# Altium schematic sheet Sheet1.SchDoc
size A1
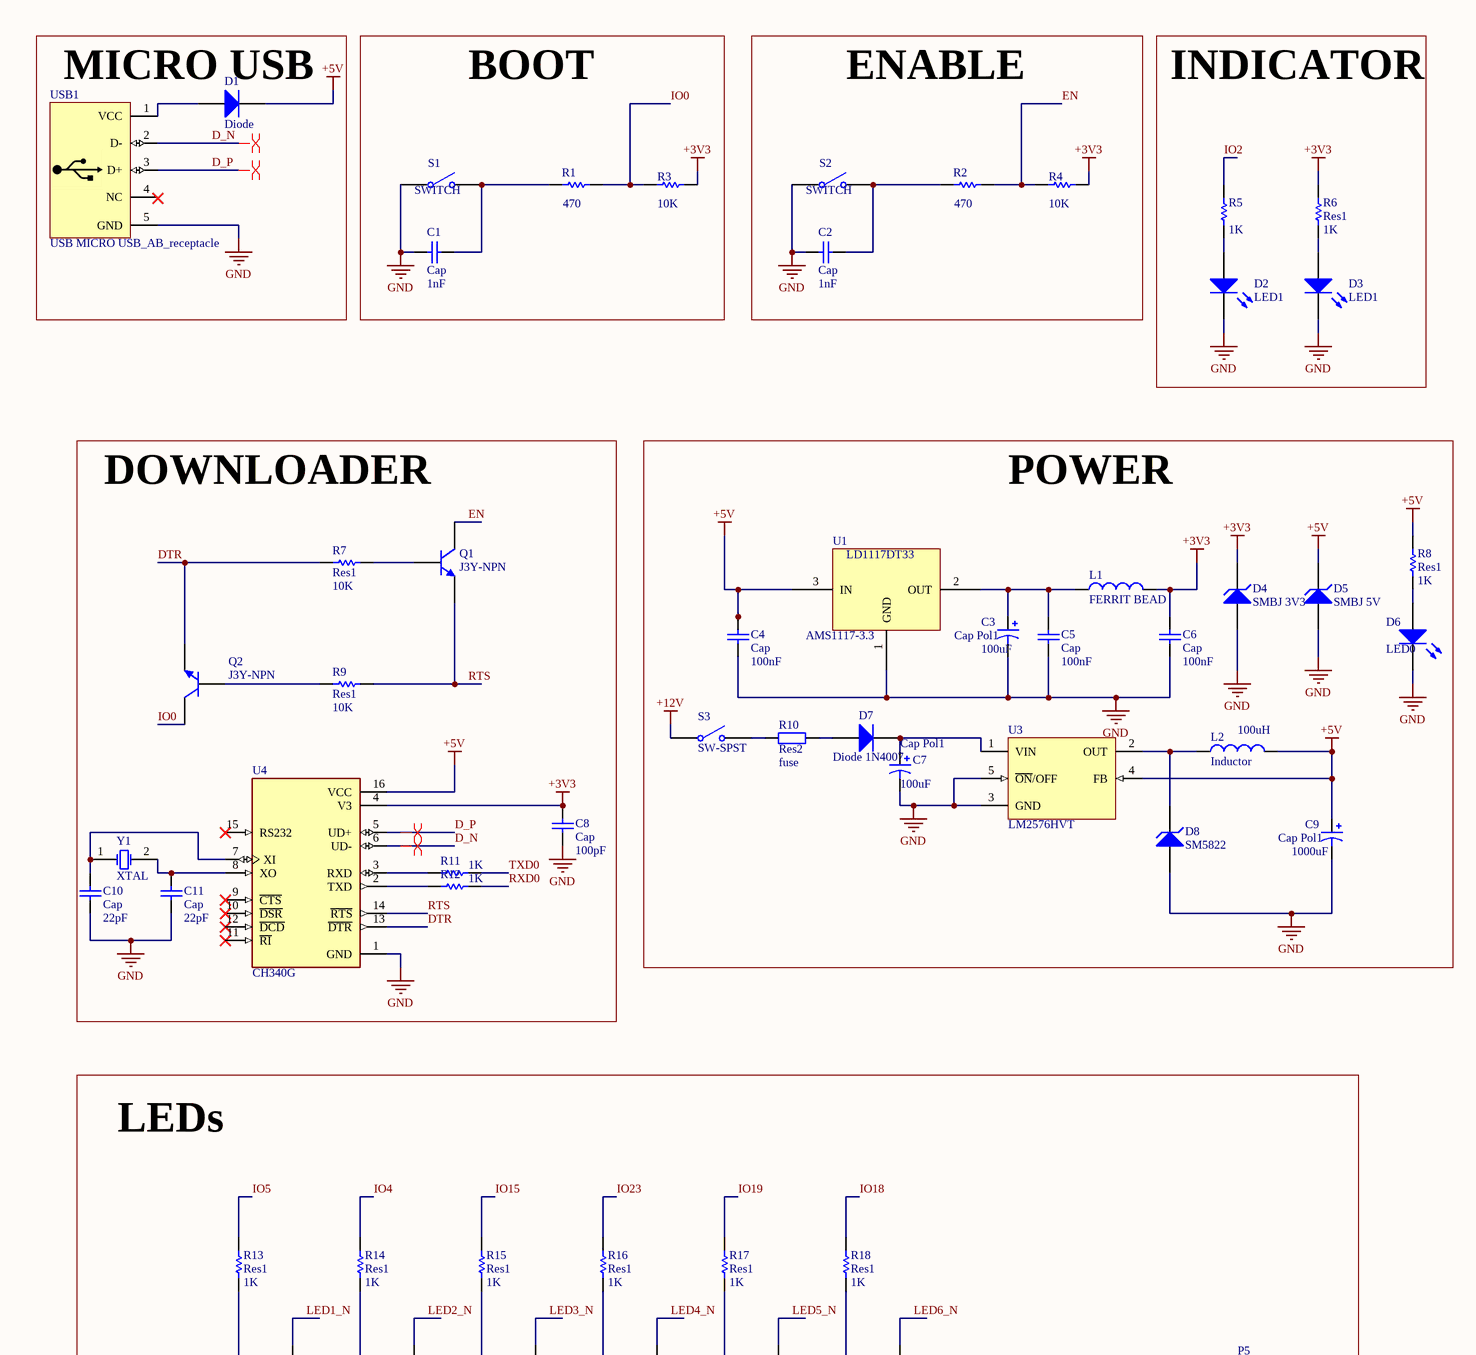
[diagram p0: Sheet1.SchDoc, top left]
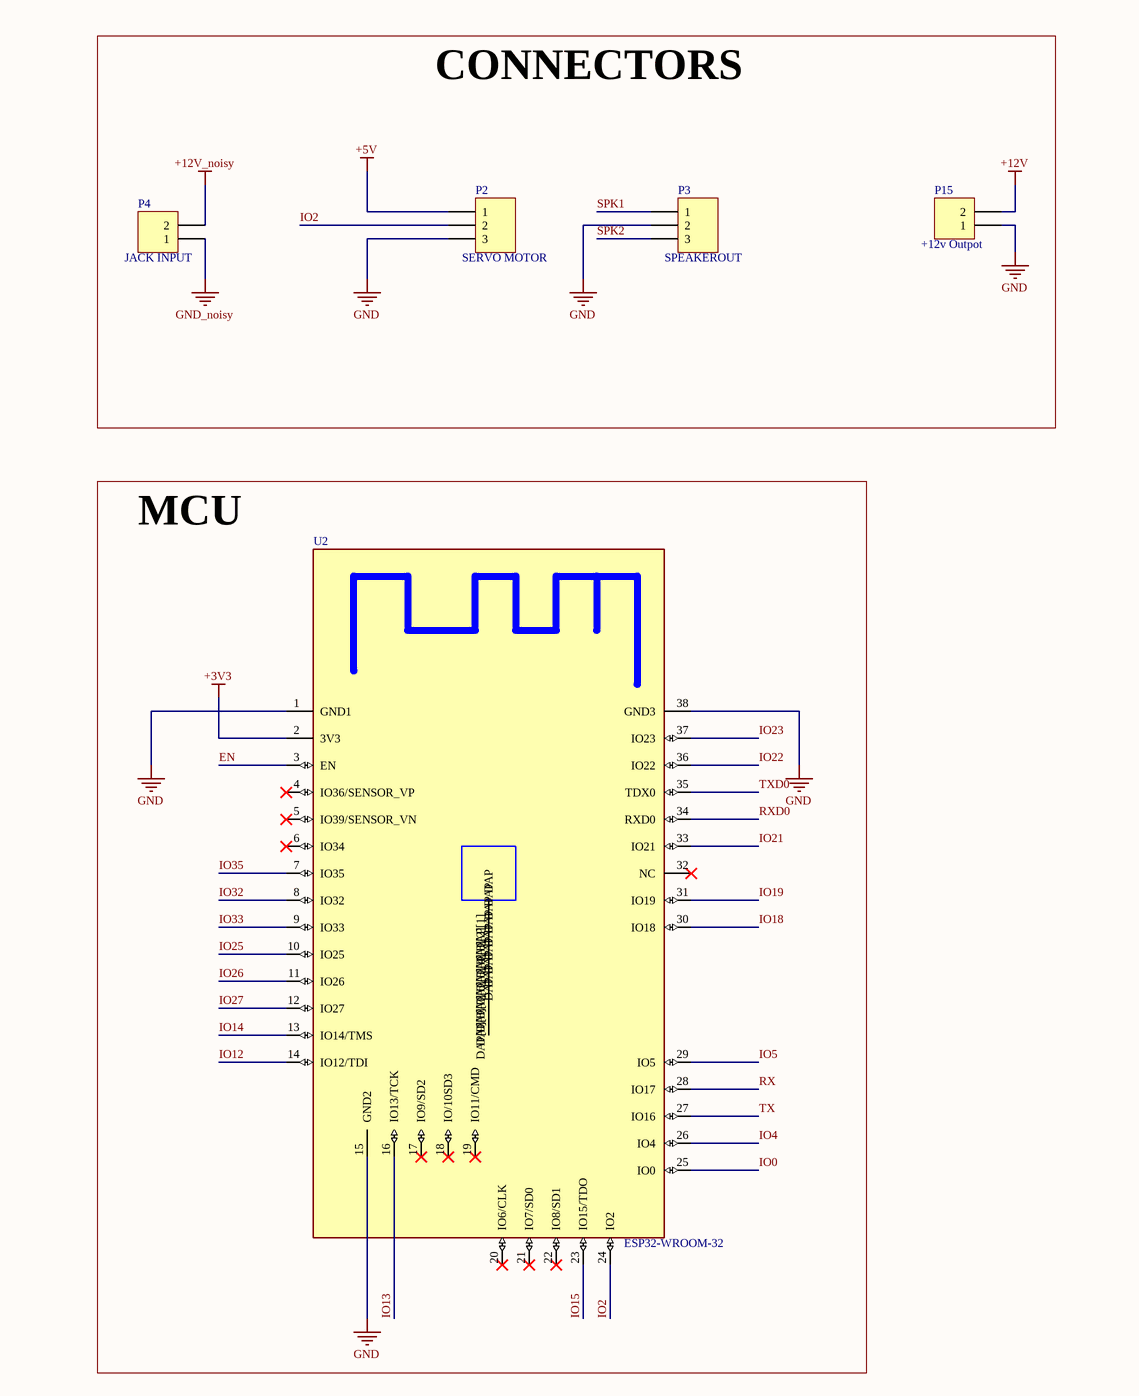
[diagram p1: Sheet1.SchDoc, top right]
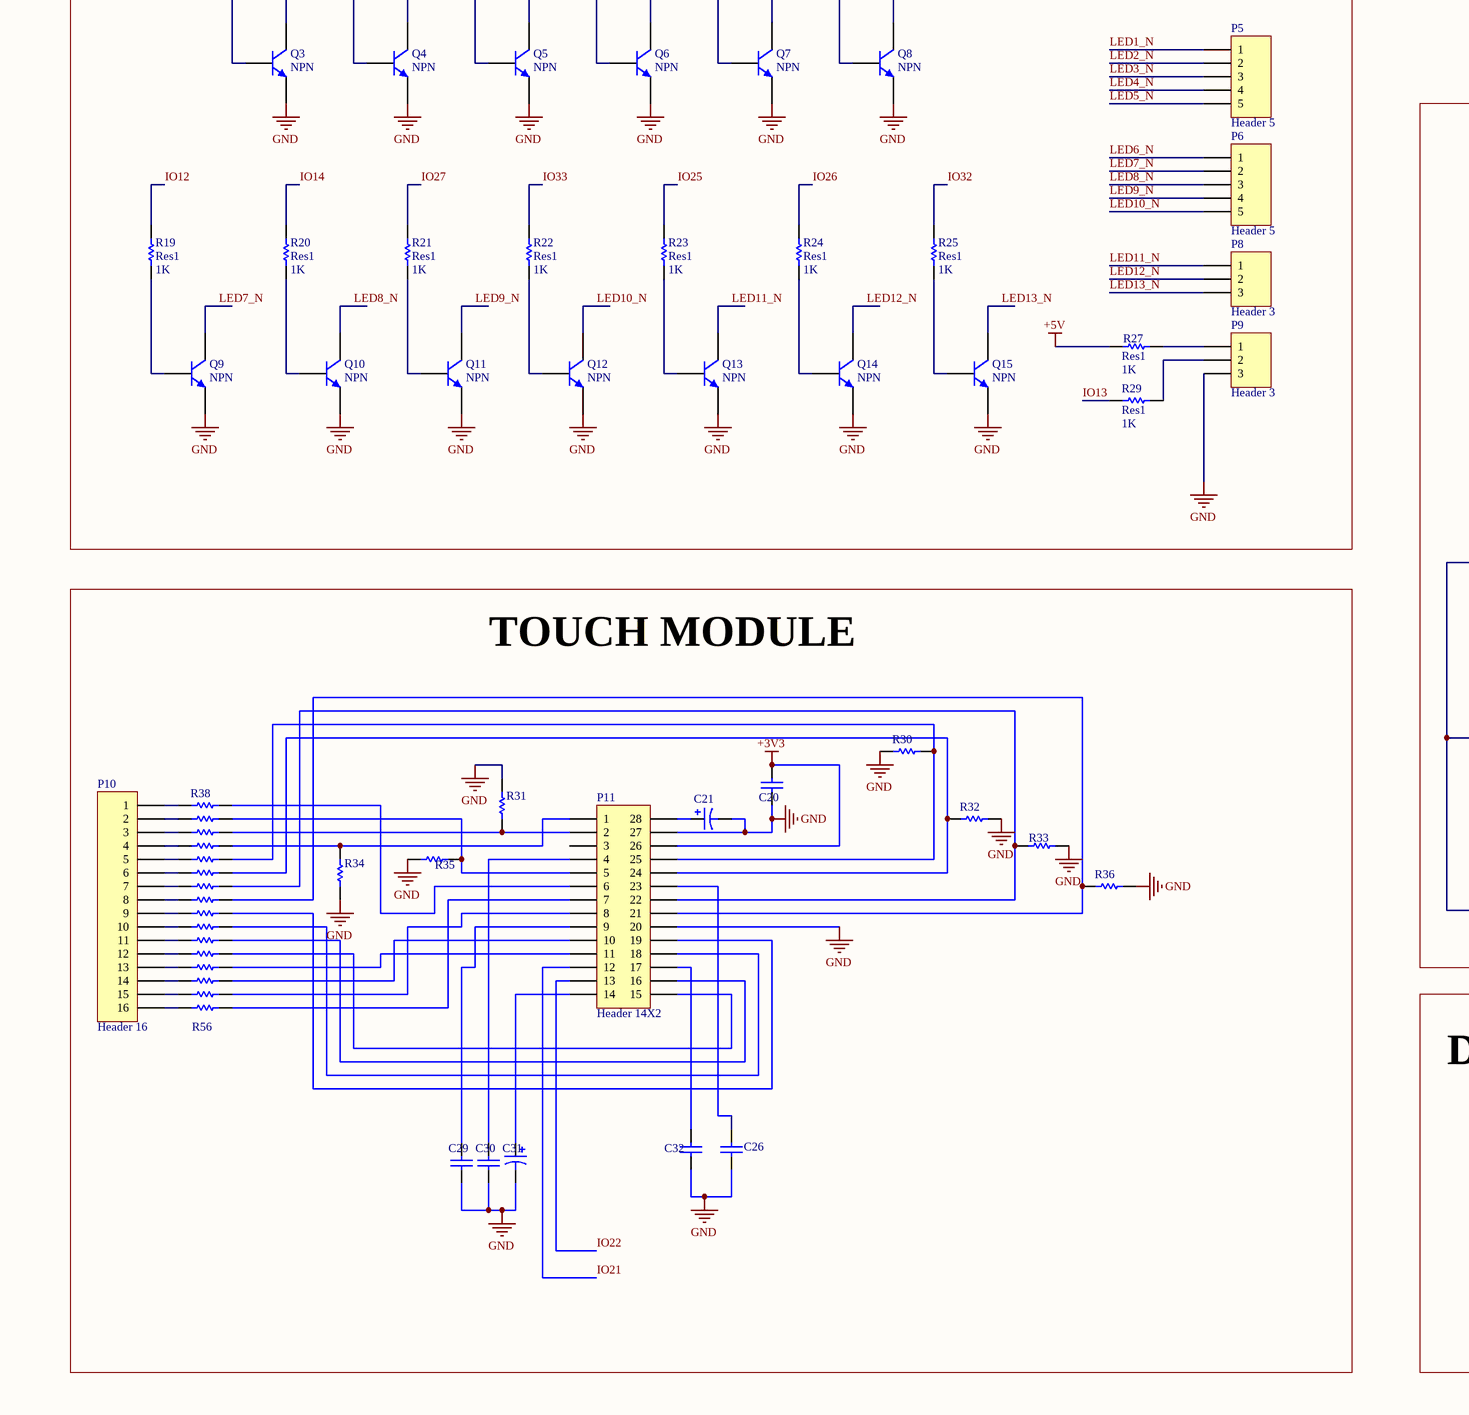
[diagram p2: Sheet1.SchDoc, bottom left]
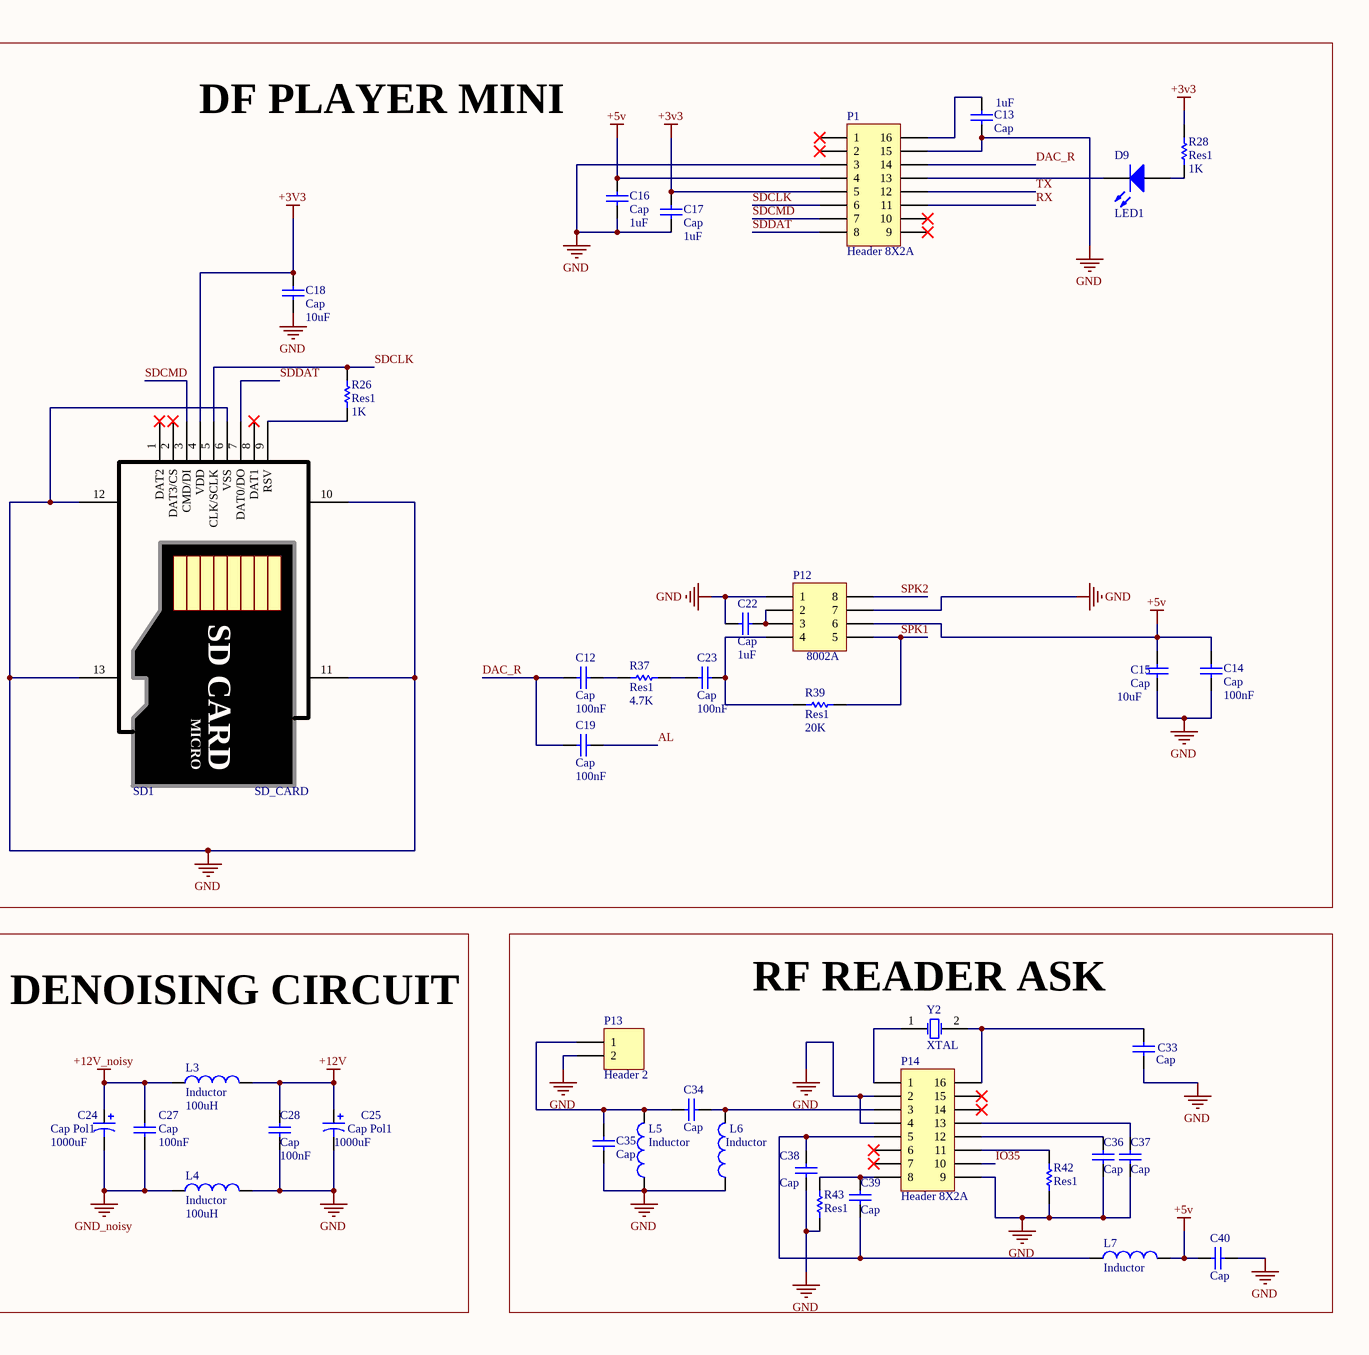
[diagram p3: Sheet1.SchDoc, bottom right]

## Parts
C1  Cap  value 1nF  [smd_805]
C2  Cap  value 1nF  [smd_805]
C3  Cap Pol1  value 100uF  [C_B]
C4  Cap  value 100nF  [smd_805]
C5  Cap  value 100nF  [smd_805]
C6  Cap  value 100nF  [smd_805]
C7  Cap Pol1  value 100uF  [C_CYL_SMD2]
C8  Cap  value 100pF  [smd_805]
C9  Cap Pol1  value 1000uF  [C_CYL_SMD]
C10  Cap  value 22pF  [smd_805]
C11  Cap  value 22pF  [smd_805]
C12  Cap  value 100nF  [smd_805]
C13  Cap  value 1uF  [smd_805]
C14  Cap  value 100nF  [smd_805]
C15  Cap  value 10uF  [smd_805]
C16  Cap  value 1uF  [smd_805]
C17  Cap  value 1uF  [smd_805]
C18  Cap  value 10uF  [smd_805]
C19  Cap  value 100nF  [smd_805]
C20  Cap  [smd_805]  (value not drawn)
C21  Cap Pol1  [c_b]  (value not drawn)
C22  Cap  value 1uF  [smd_805]
C23  Cap  value 100nF  [smd_805]
C24  Cap Pol1  value 1000uF  [cap_pol_25v]
C25  Cap Pol1  value 1000uF  [cap_pol_25v]
C26  Cap  [smd_805]  (value not drawn)
C27  Cap  value 100nF  [smd_805]
C28  Cap  value 100nF  [smd_805]
C29  Cap  [smd_805]  (value not drawn)
C30  Cap  [smd_805]  (value not drawn)
C31  Cap Pol1  [C_B]  (value not drawn)
C32  Cap  [smd_805]  (value not drawn)
C33  Cap  [0603]
C34  Cap  [0603]
C35  Cap  [0603]
C36  Cap  [0603]
C37  Cap  [0603]
C38  Cap  [0603]
C39  Cap  [0603]
C40  Cap  [0603]
D1  Diode  [DO-214AC]
D2  LED1  [smd_805]
D3  LED1  [smd_805]
D4  SMBJ 3V3  [TVS]
D5  SMBJ 5V  [TVS]
D6  LED0  [smd_805]
D7  Diode 1N4007  [TVS]
D8  SM5822  [DO_214_AB_SMC]
D9  LED1  [smd_805]
L1  FERRIT BEAD  [smd_805]
L2  Inductor  value 100uH  [induc_smd]
L3  Inductor  value 100uH  [induc_smd]
L4  Inductor  value 100uH  [induc_smd]
L5  Inductor  [0603]
L6  Inductor  [0603]
L7  Inductor  [0603]
P1  Header 8X2A  [SOP16]
P2  SERVO MOTOR  [PHOENIX_3]
P3  SPEAKEROUT  [PHOENIX_3]
P4  JACK INPUT  [ADAP_JACK]
P5  Header 5  [PHOENIX_5]
P6  Header 5  [PHOENIX_5]
P8  Header 3  [PHOENIX_3]
P9  Header 3  [PHOENIX_3]
P10  Header 16  [HDR1X16]
P11  Header 14X2  [ssop28]
P12  8002A  [sop8]
P13  Header 2  [HDR1X2]
P14  Header 8X2A  [SOP16]
P15  +12v Outpot  [PHOENIX_2]
Q1  J3Y-NPN  [sot-23]
Q2  J3Y-NPN  [sot-23]
Q3  NPN  [to-92]
Q4  NPN  [to-92]
Q5  NPN  [to-92]
Q6  NPN  [to-92]
Q7  NPN  [to-92]
Q8  NPN  [to-92]
Q9  NPN  [to-92]
Q10  NPN  [to-92]
Q11  NPN  [to-92]
Q12  NPN  [to-92]
Q13  NPN  [to-92]
Q14  NPN  [to-92]
Q15  NPN  [to-92]
R1  value 470  [smd_805]  (hidden comment: Res1)
R2  value 470  [smd_805]  (hidden comment: Res1)
R3  value 10K  [smd_805]  (hidden comment: Res1)
R4  value 10K  [smd_805]  (hidden comment: Res1)
R5  value 1K  [smd_805]  (hidden comment: Res1)
R6  Res1  value 1K  [smd_805]
R7  Res1  value 10K  [smd_805]
R8  Res1  value 1K  [smd_805]
R9  Res1  value 10K  [smd_805]
R10  Res2  value fuse  [smd_1206]
R11  value 1K  [smd_805]  (hidden comment: Res1)
R12  value 1K  [smd_805]  (hidden comment: Res1)
R13  Res1  value 1K  [smd_805]
R14  Res1  value 1K  [smd_805]
R15  Res1  value 1K  [smd_805]
R16  Res1  value 1K  [smd_805]
R17  Res1  value 1K  [smd_805]
R18  Res1  value 1K  [smd_805]
R19  Res1  value 1K  [smd_805]
R20  Res1  value 1K  [smd_805]
R21  Res1  value 1K  [smd_805]
R22  Res1  value 1K  [smd_805]
R23  Res1  value 1K  [smd_805]
R24  Res1  value 1K  [smd_805]
R25  Res1  value 1K  [smd_805]
R26  Res1  value 1K  [smd_805]
R27  Res1  value 1K  [smd_805]
R28  Res1  value 1K  [smd_805]
R29  Res1  value 1K  [smd_805]
R30  Res1  [smd_805]  (value not drawn)
R31  Res1  [smd_805]  (value not drawn)
R32  Res1  [smd_805]  (value not drawn)
R33  Res1  [smd_805]  (value not drawn)
R34  Res1  [smd_805]  (value not drawn)
R35  Res1  [smd_805]  (value not drawn)
R36  Res1  [smd_805]  (value not drawn)
R37  Res1  value 4.7K  [smd_805]
R38  Res1  [smd_805]  (value not drawn)
R39  Res1  value 20K  [smd_805]
R40  Res1  [smd_805]  (value not drawn)
R41  Res1  [smd_805]  (value not drawn)
R42  Res1  [0603]
R43  Res1  [0603]
R44  Res1  [smd_805]  (value not drawn)
R45  Res1  [smd_805]  (value not drawn)
R46  Res1  [smd_805]  (value not drawn)
R47  Res1  [smd_805]  (value not drawn)
R48  Res1  [smd_805]  (value not drawn)
R49  Res1  [smd_805]  (value not drawn)
R50  Res1  [smd_805]  (value not drawn)
R51  Res1  [smd_805]  (value not drawn)
R52  Res1  [smd_805]  (value not drawn)
R53  Res1  [smd_805]  (value not drawn)
R54  Res1  [smd_805]  (value not drawn)
R55  Res1  [smd_805]  (value not drawn)
R56  Res1  [smd_805]  (value not drawn)
S1  SWITCH  [SW_SMd_2pin]
S2  SWITCH  [SW_SMd_2pin]
S3  SW-SPST  [KEY1]
SD1  SD_CARD  [SD_CARD_HOLDER]
U1  AMS1117-3.3  [SOT223]
U2  ESP32-WROOM-32  [ESP32-WROOM-32]
U3  LM2576HVT  [LM2576]
U4  CH340G  [SOIC127P600X180-16N]
USB1  USB MICRO USB_AB_receptacle  [USB_MICRO_USB_AB_receptacle]
Y1  XTAL  [crystal]
Y2  XTAL  [crystal]

## Blocks framed on the sheet
MICRO USB: D1 USB1
BOOT: C1 R1 R3 S1
ENABLE: C2 R2 R4 S2
INDICATOR: D2 D3 R5 R6
CONNECTORS: P2-P4 P15
DOWNLOADER: C8 C10 C11 Q1 Q2 R7 R9 R11 R12 U4 Y1
POWER: C3-C7 C9 D4-D8 L1 L2 R8 R10 S3 U1 U3
MCU: U2
LEDs: P5 P6 P8 P9 Q3-Q15 R13-R25 R27 R29
DF PLAYER MINI: C12-C19 C22 C23 D9 P1 P12 R26 R28 R37 R39 SD1
TOUCH MODULE: C20 C21 C26 C29-C32 P10 P11 R30-R36 R38 R40 R41 R44-R56
DENOISING CIRCUIT: C24 C25 C27 C28 L3 L4
RF READER ASK: C33-C40 L5-L7 P13 P14 R42 R43 Y2

## Nets
+3V3: C6.1 C8.2 C17.2 C18.2 C20.2 D4.2(K) L1.2 P1.5 P11.26 R3.2 R4.2 R6.2 R28.2 SD1.4(VDD) U2.2(3V3) U4.4(V3)
+5v: C4.1 C9.1 C14.2 C15.2 C16.2 C40.2 D1.2(K) D5.2(K) L2.2 L7.2 P1.4 P2.1 P12.6 R8.2 R27.1 U1.3(IN) U3.4(FB) U4.16(VCC)
+12V: C25.1 C28.1 L3.2 P15.2 S3.1(COMMON)
+12V_noisy: C24.1 C27.1 L3.1 P4.2
GND: C1.1 C2.1 C3.2 C4.2 C5.2 C6.2 C7.2 C8.1 C9.2 C10.1 C11.1 C13.2 C14.1 C15.1 C16.1 C17.1 C18.1 C20.1 C21.2 C22.1 C25.2 C26.1 C28.2 C29.1 C30.1 C31.2 C32.2 C33.2 C35.2 C36.2 C37.2 C38.2 C40.1 D2.2(K) D3.2(K) D4.1(A) D5.1(A) D6.2(K) D8.1(A) L4.2 L5.1 L6.1 P1.3 P1.15 P2.3 P3.2 P9.3 P11.20 P11.27 P12.1 P12.7 P13.2 P14.2 P14.4 P14.9 P15.1 Q3.1(E) Q4.1(E) Q5.1(E) Q6.1(E) Q7.1(E) Q8.1(E) Q9.1(E) Q10.1(E) Q11.1(E) Q12.1(E) Q13.1(E) Q14.1(E) Q15.1(E) R30.1 R31.1 R32.1 R33.1 R34.1 R35.1 R36.1 R42.1 R43.1 S1.1(COMMON) S2.1(COMMON) SD1.6(VSS) SD1.10(BODY) SD1.11(BODY) SD1.12(BODY) SD1.13(BODY) U1.1(GND) U2.1(GND1) U2.15(GND2) U2.38(GND3) U3.3(GND) U3.5(~{ON}/OFF) U4.1(GND) USB1.5(GND)
GND_noisy: C24.2 C27.2 L4.1 P4.1
AL: C19.1
D_N: U4.6(UD-) USB1.2(D-)
D_P: U4.5(UD+) USB1.3(D+)
DAC_R: C12.2 C19.2 P1.14
DTR: Q2.2(E) R7.1 U4.13(~{DTR})
EN: Q1.3(C) R2.2 R4.1 U2.3(EN)
IO0: Q2.3(C) R1.2 R3.1 U2.25(IO0)
IO2: P2.2 R5.2 U2.24(IO2)
IO4: R14.2 U2.26(IO4)
IO5: R13.2 U2.29(IO5)
IO12: R19.2 U2.14(IO12/TDI)
IO13: R29.2 U2.16(IO13/TCK)
IO14: R20.2 U2.13(IO14/TMS)
IO15: R15.2 U2.23(IO15/TDO)
IO18: R18.2 U2.30(IO18)
IO19: R17.2 U2.31(IO19)
IO21: P11.12 U2.33(IO21)
IO22: P11.13 U2.36(IO22)
IO23: R16.2 U2.37(IO23)
IO25: R23.2 U2.10(IO25)
IO26: R24.2 U2.11(IO26)
IO27: R21.2 U2.12(IO27)
IO32: R25.2 U2.8(IO32)
IO33: R22.2 U2.9(IO33)
IO35: P14.10 U2.7(IO35)
LED1_N: P5.1 Q3.2(C)
LED2_N: P5.2 Q4.2(C)
LED3_N: P5.3 Q5.2(C)
LED4_N: P5.4 Q6.2(C)
LED5_N: P5.5 Q7.2(C)
LED6_N: P6.1 Q8.2(C)
LED7_N: P6.2 Q9.2(C)
LED8_N: P6.3 Q10.2(C)
LED9_N: P6.4 Q11.2(C)
LED10_N: P6.5 Q12.2(C)
LED11_N: P8.1 Q13.2(C)
LED12_N: P8.2 Q14.2(C)
LED13_N: P8.3 Q15.2(C)
RTS: Q1.2(E) R9.2 U4.14(~{RTS})
RX: P1.11 U2.28(IO17)
RXD0: R12.2 U2.34(RXD0)
SDCLK: P1.6 R26.2 SD1.5(CLK/SCLK)
SDCMD: P1.7 SD1.3(CMD/DI)
SDDAT: P1.8 SD1.7(DAT0/DO)
SPK1: P3.1 P12.5 R39.2
SPK2: P3.3 P12.8
TX: P1.12 U2.27(IO16)
TXD0: R11.2 U2.35(TDX0)
NetC1_2: C1.2 R1.1 S1.2(NO)
NetC2_2: C2.2 R2.1 S2.2(NO)
NetC3_1: C3.1 C5.1 L1.1 U1.2(OUT)
NetC7_1: C7.1 D7.2(K) U3.1(VIN)
NetC10_2: C10.2 U4.7(XI) Y1.1(OSC1)
NetC11_2: C11.2 U4.8(XO) Y1.2(OSC2)
NetC12_1: C12.1 R37.1
NetC13_1: C13.1 P1.16
NetC21_1: C21.1 P11.28
NetC22_2: C22.2 P12.2 P12.3
NetC23_1: C23.1 P12.4 R39.1
NetC23_2: C23.2 R37.2
NetC26_2: C26.2 P11.23
NetC29_2: C29.2 P11.9
NetC30_2: C30.2 P11.4
NetC31_1: C31.1 P11.14
NetC32_1: C32.1 P11.17
NetC33_1: C33.1 P14.16 Y2.2(OSC2)
NetC34_1: C34.1 C35.1 L5.2 P13.1
NetC34_2: C34.2 L6.2 P14.3
NetC36_1: C36.1 P14.12
NetC37_1: C37.1 P14.13
NetC38_1: C38.1 C39.2 L7.1 P14.5
NetC39_1: C39.1 P14.8 R43.2
NetD1_1: D1.1(A) USB1.1(VCC)
NetD2_1: D2.1(A) R5.1
NetD3_1: D3.1(A) R6.1
NetD6_1: D6.1(A) R8.1
NetD7_1: D7.1(A) R10.2
NetD8_2: D8.2(K) L2.1 U3.2(OUT)
NetD9_1: D9.1(A) R28.1
NetD9_2: D9.2(K) P1.13
NetP9_1: P9.1 R27.2
NetP9_2: P9.2 R29.1
NetP10_1: P10.1 R38.1
NetP10_2: P10.2 R40.1
NetP10_3: P10.3 R41.1
NetP10_4: P10.4 R44.1
NetP10_5: P10.5 R45.1
NetP10_6: P10.6 R46.1
NetP10_7: P10.7 R47.1
NetP10_8: P10.8 R48.1
NetP10_9: P10.9 R49.1
NetP10_10: P10.10 R50.1
NetP10_11: P10.11 R51.1
NetP10_12: P10.12 R52.1
NetP10_13: P10.13 R53.1
NetP10_14: P10.14 R54.1
NetP10_15: P10.15 R55.1
NetP10_16: P10.16 R56.1
NetP11_1: P11.1 R34.2 R44.2
NetP11_2: P11.2 R31.2 R41.2
NetP11_5: P11.5 R35.2 R40.2
NetP11_6: P11.6 R38.2
NetP11_7: P11.7 R56.2
NetP11_8: P11.8 R55.2
NetP11_10: P11.10 R54.2
NetP11_11: P11.11 R53.2
NetP11_15: P11.15 R52.2
NetP11_16: P11.16 R51.2
NetP11_18: P11.18 R50.2
NetP11_19: P11.19 R49.2
NetP11_21: P11.21 R36.2 R48.2
NetP11_22: P11.22 R33.2 R47.2
NetP11_24: P11.24 R32.2 R46.2
NetP11_25: P11.25 R30.2 R45.2
NetP14_1: P14.1 Y2.1(OSC1)
NetP14_11: P14.11 R42.2
NetQ1_1: Q1.1(B) R7.2
NetQ2_1: Q2.1(B) R9.1
NetQ3_3: Q3.3(B) R13.1
NetQ4_3: Q4.3(B) R14.1
NetQ5_3: Q5.3(B) R15.1
NetQ6_3: Q6.3(B) R16.1
NetQ7_3: Q7.3(B) R17.1
NetQ8_3: Q8.3(B) R18.1
NetQ9_3: Q9.3(B) R19.1
NetQ10_3: Q10.3(B) R20.1
NetQ11_3: Q11.3(B) R21.1
NetQ12_3: Q12.3(B) R22.1
NetQ13_3: Q13.3(B) R23.1
NetQ14_3: Q14.3(B) R24.1
NetQ15_3: Q15.3(B) R25.1
NetR10_1: R10.1 S3.2(NO)
NetR11_1: R11.1 U4.3(RXD)
NetR12_1: R12.1 U4.2(TXD)
NetR26_1: R26.1 SD1.9(RSV)

Not connected (* = marked no-connect by the designer): P1 1* 2* 9* 10*; P11 3; P14 6* 7* 14* 15*; SD1 1(DAT2)* 2(DAT3/CS)* 8(DAT1)*; U2 4(IO36/SENSOR_VP)* 5(IO39/SENSOR_VN)* 6(IO34)* 17(IO9/SD2)* 18(IO/10SD3)* 19(IO11/CMD)* 20(IO6/CLK)* 21(IO7/SD0)* 22(IO8/SD1)* 32(NC)* DAP[1](DAP) DAP[2](DAP) DAP[3](DAP) DAP[4](DAP) DAP[5](DAP) DAP[6](DAP) DAP[7](DAP) DAP[8](DAP) DAP[9](DAP); U4 9(~{CTS})* 10(~{DSR})* 11(~{RI})* 12(~{DCD})* 15(RS232)*; USB1 4(NC)

## Layout directives
differential pair: D_N, D_P

## Notes on the sheet
- (in symbol MICRO_SD_CARD_HOLDER) SD CARD; MICRO

## Library data of the parts
C1 C2 C4-C6 C8 C10-C19 C22 C23 C27 C28 = Cap: Capacitor; Published: 8-Jun-2000; LatestRevisionDate: 17-Jul-2002; LatestRevisionNote: Re-released for DXP Platform.; PackageReference: RAD-0.3; Publisher: Altium Limited
C3 C7 C9 C24 C25 = Cap Pol1: Polarized Capacitor (Radial); Published: 8-Jun-2000; LatestRevisionDate: 17-Jul-2002; LatestRevisionNote: Re-released for DXP Platform.; PackageReference: RB7.6-15; Publisher: Altium Limited
C20 C26 C29 C30 C32 = Cap: Capacitor; Value: 100pF; Published: 8-Jun-2000; LatestRevisionDate: 17-Jul-2002; LatestRevisionNote: Re-released for DXP Platform.; PackageReference: RAD-0.3; Publisher: Altium Limited
C21 C31 = Cap Pol1: Polarized Capacitor (Radial); Value: 100pF; Published: 8-Jun-2000; LatestRevisionDate: 17-Jul-2002; LatestRevisionNote: Re-released for DXP Platform.; PackageReference: RB7.6-15; Publisher: Altium Limited
C33-C40 = Cap: Capacitor; Value: 100nF; Published: 8-Jun-2000; LatestRevisionDate: 17-Jul-2002; LatestRevisionNote: Re-released for DXP Platform.; PackageReference: RAD-0.3; Publisher: Altium Limited
D1 = Diode: SS110-A; Published: 8-Jun-2000; LatestRevisionDate: 17-Jul-2002; LatestRevisionNote: Re-released for DXP Platform.; PackageVersion: Sep-1996; PackageReference: SMC; Publisher: Altium Limited; Code_JEDEC: DO-214-AB
D2 D3 D9 = LED1: Typical RED GaAs LED; Published: 8-Jun-2000; LatestRevisionDate: 08-Jul-2005; LatestRevisionNote: Mech Layer 1 removed.; PackageReference: LED-1; Publisher: Altium Limited
D4 D5 D8 = D Zener: Zener Diode; Published: 8-Jun-2000; LatestRevisionDate: 17-Jul-2002; LatestRevisionNote: Re-released for DXP Platform.; PackageReference: DIODE-0.7; Publisher: Altium Limited
D6 = LED0: Typical INFRARED GaAs LED; Published: 8-Jun-2000; LatestRevisionDate: 08-Jul-2005; LatestRevisionNote: Mech Layer 1 removed.; PackageReference: LED-0; Publisher: Altium Limited
D7 = Diode 1N4007: 1 Amp General Purpose Rectifier; Published: 8-Jun-2000; LatestRevisionDate: 17-Jul-2002; LatestRevisionNote: Re-released for DXP Platform.; DatasheetVersion: 1998; PackageVersion: Aug-1999; PackageReference: DO-41; Publisher: Altium Limited; Code_JEDEC: DO-204-AL; ComponentLink1Description: Manufacturer Link; ComponentLink1URL: http://www.fairchildsemi.com/; ComponentLink2Description: Datasheet; ComponentLink2URL: http://www.fairchildsemi.com/ds/1N%2F1N4001.pdf
L1-L4 = Inductor: Code_IEC: 1005; Published: 8-Jun-2000; LatestRevisionDate: 29-May-2009; LatestRevisionNote: IPC-7351 Footprint Added.; PackageReference: 0402-A; Publisher: Altium Limited; PackageDescription: Chip Inductor; Code_JEITA: 0402
L5-L7 = Inductor: Code_IEC: 1005; Value: 100uH; Published: 8-Jun-2000; LatestRevisionDate: 29-May-2009; LatestRevisionNote: IPC-7351 Footprint Added.; PackageReference: 0402-A; Publisher: Altium Limited; PackageDescription: Chip Inductor; Code_JEITA: 0402
P1 P14 = Header 8X2A: Header, 8-Pin, Dual row; LatestRevisionDate: 17-Jul-2002; LatestRevisionNote: Re-released for DXP Platform.; Publisher: Altium Limited
P2 P3 P8 P9 = Header 3: Header, 3-Pin; LatestRevisionDate: 17-Jul-2002; LatestRevisionNote: Re-released for DXP Platform.; Publisher: Altium Limited
P4 P13 P15 = Header 2: Header, 2-Pin; LatestRevisionDate: 17-Jul-2002; LatestRevisionNote: Re-released for DXP Platform.; Publisher: Altium Limited
P5 P6 = Header 5: Header, 5-Pin; LatestRevisionDate: 17-Jul-2002; LatestRevisionNote: Re-released for DXP Platform.; Publisher: Altium Limited
P10 = Header 16: Header, 16-Pin; LatestRevisionDate: 17-Jul-2002; LatestRevisionNote: Re-released for DXP Platform.; Publisher: Altium Limited
P11 = Header 14X2: Header, 14-Pin, Dual row; LatestRevisionDate: 17-Jul-2002; LatestRevisionNote: Re-released for DXP Platform.; Publisher: Altium Limited
P12 = Header 4X2: Header, 4-Pin, Dual row; LatestRevisionDate: 17-Jul-2002; LatestRevisionNote: Re-released for DXP Platform.; Publisher: Altium Limited
Q1-Q15 = NPN: NPN Bipolar Transistor; Published: 8-Jun-2000; LatestRevisionDate: 17-Jul-2002; LatestRevisionNote: Re-released for DXP Platform.; PackageReference: TO-226; Publisher: Altium Limited; Code_JEDEC: TO-226-AA
R1-R9 R11-R29 R37 R39 = Res1: Resistor; Published: 8-Jun-2000; LatestRevisionDate: 17-Jul-2002; LatestRevisionNote: Re-released for DXP Platform.; PackageReference: AXIAL-0.3; Publisher: Altium Limited
R10 = Res2: Resistor; Published: 8-Jun-2000; LatestRevisionDate: 17-Jul-2002; LatestRevisionNote: Re-released for DXP Platform.; PackageReference: AXIAL-0.4; Publisher: Altium Limited
R30-R36 = Res1: Resistor; Value: 1K; Published: 8-Jun-2000; LatestRevisionDate: 17-Jul-2002; LatestRevisionNote: Re-released for DXP Platform.; PackageReference: AXIAL-0.3; Publisher: Altium Limited
R38 R40 R41 R44-R56 = Res1: Resistor; Value: 22K; Published: 8-Jun-2000; LatestRevisionDate: 17-Jul-2002; LatestRevisionNote: Re-released for DXP Platform.; PackageReference: AXIAL-0.3; Publisher: Altium Limited
R42 R43 = Res1: Resistor; Value: 24K; Published: 8-Jun-2000; LatestRevisionDate: 17-Jul-2002; LatestRevisionNote: Re-released for DXP Platform.; PackageReference: AXIAL-0.3; Publisher: Altium Limited
S1-S3 = SW-SPST: Single-Pole, Single-Throw Switch; Published: 24-Mar-1999; LatestRevisionDate: 17-Jul-2002; LatestRevisionNote: Re-released for DXP Platform.; PackageReference: SPST-2; Publisher: Altium Limited
SD1 = MICRO_SD_CARD_HOLDER
U1 = LD1117DT33
U2 = ESP32-WROOM-32: MP: ESP32WROOM32; MF: Quectel; SnapEDA_Link: https://www.snapeda.com/parts/ESP32WROOM32/Quectel/view-part/?ref=snap; Availability: Not in stock; Package: None; Check_prices: https://www.snapeda.com/parts/ESP32WROOM32/Quectel/view-part/?ref=eda; Value: *; Price: None
U3 = LM2576HVT-3.3: SIMPLE SWITCHER® 3A Step-Down Voltage Regulator, 5-pin TO-220; Manufacturer: National Semiconductor; PackageTopMarking: NSUZXYTT*LM2576HVT*-3.3 P+; Published: 4-Dec-2008; DatasheetVersion: Aug-2004; PackageVersion: revJ, Jan-1992; PackageReference: T05A; Publisher: Altium Limited; PackageDescription: TO-220, Molded, 5 Lead, Straight; PartNumber: LM2576HVT-3.3; RoHS: Y; PinCount: 5; CompType: Switcher; Code_JEDEC: TO-220-AB; ComponentLink1Description: LM2576HV Datasheet; ComponentLink1URL: http://www.national.com/ds/LM/LM2576HV.pdf; ComponentLink2Description: LM2576HV Web Page
U4 = CH340G: USB Interface Integrated Circuit; MF: WCH; Value: *; SnapEDA_Link: https://www.snapeda.com/parts/Ch340G/WCH/view-part/?ref=snap; MP: Ch340G; Check_prices: https://www.snapeda.com/parts/Ch340G/WCH/view-part/?ref=eda; Availability: Not in stock; Price: None; Package: None
Y1 Y2 = XTAL: Crystal Oscillator 12MHZ; Published: 8-Jun-2000; LatestRevisionDate: 17-Jul-2002; LatestRevisionNote: Re-released for DXP Platform.; PackageReference: R38; Publisher: Altium Limited